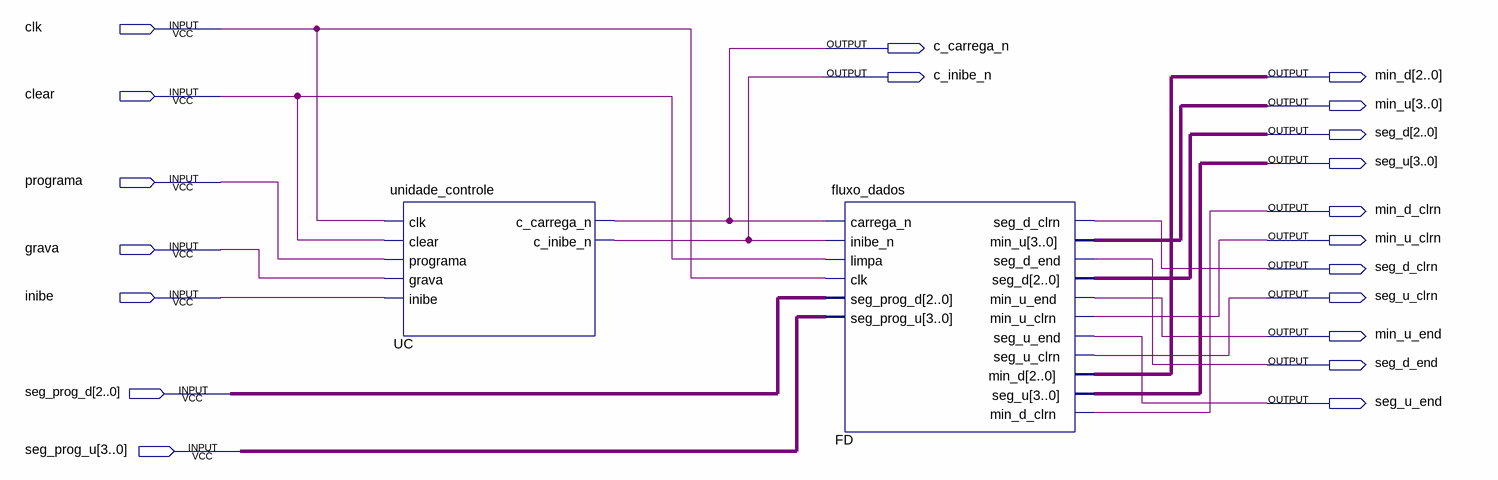
[diagram p0: schematic sheet]
// Quartus schematic relogio.bdf as structural Verilog: 2 symbols, 20 pins
module relogio (
  input  clk,
  input  clear,
  input  programa,
  input  grava,
  input  inibe,
  input  [2:0] seg_prog_d,
  input  [3:0] seg_prog_u,
  output c_carrega_n,
  output c_inibe_n,
  output [2:0] min_d,
  output [3:0] min_u,
  output [2:0] seg_d,
  output [3:0] seg_u,
  output min_d_clrn,
  output min_u_clrn,
  output seg_d_clrn,
  output seg_u_clrn,
  output min_u_end,
  output seg_d_end,
  output seg_u_end
);

  unidade_controle UC (
    .clk(clk), .clear(clear), .programa(programa), .grava(grava), .inibe(inibe), .c_carrega_n(c_carrega_n),
    .c_inibe_n(c_inibe_n));
  fluxo_dados FD (
    .carrega_n(c_carrega_n), .inibe_n(c_inibe_n), .limpa(clear), .clk(clk), .seg_prog_d(seg_prog_d),
    .seg_prog_u(seg_prog_u), .seg_d_clrn(seg_d_clrn), .min_u(min_u), .seg_d_end(seg_d_end), .seg_d(seg_d),
    .min_u_end(min_u_end), .min_u_clrn(min_u_clrn), .seg_u_end(seg_u_end), .seg_u_clrn(seg_u_clrn),
    .min_d(min_d), .seg_u(seg_u), .min_d_clrn(min_d_clrn));
endmodule
